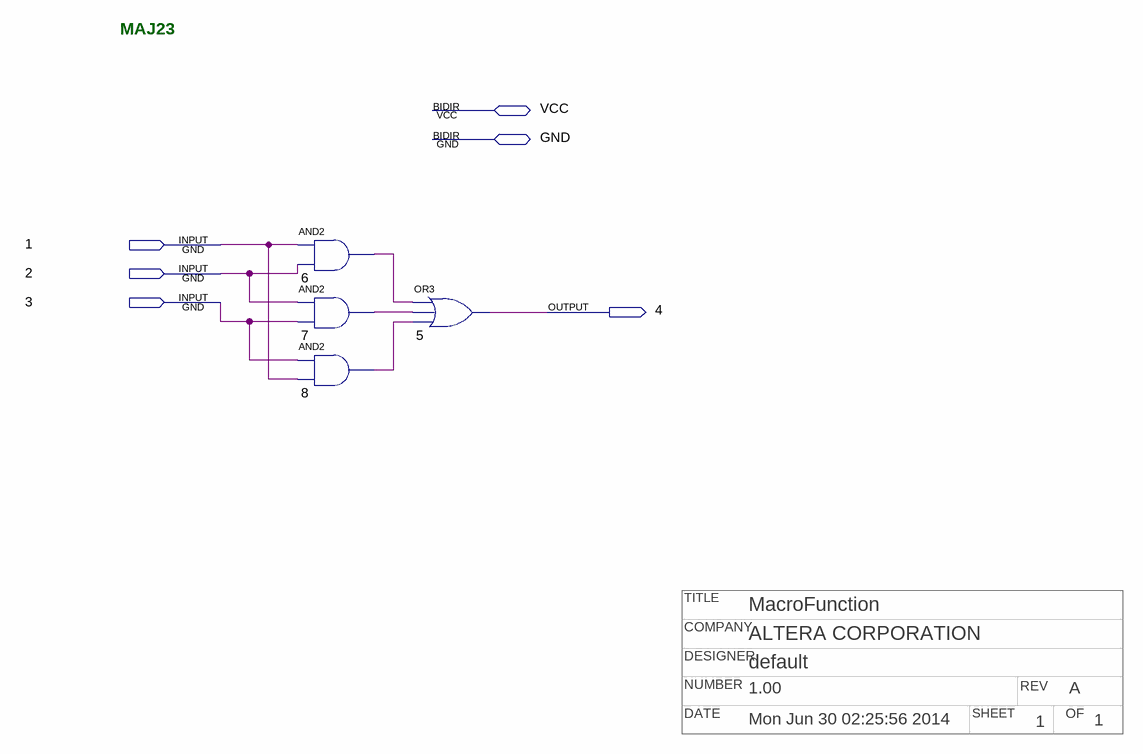
[diagram p0: schematic sheet]
// Quartus schematic npmaj23.bdf as structural Verilog: 4 symbols, 6 pins
// Title block: TITLE: MacroFunction; COMPANY: ALTERA CORPORATION; DESIGNER: default; NUMBER: 1.00; REV: A; DATE: Mon Jun 30 02:25:56 2014; SHEET: 1; OF: 1
module npmaj23 (
  input  \1 ,
  input  \2 ,
  input  \3 ,
  inout  VCC,
  inout  GND,
  output \4 
);

  wire n6_out, n7_out, n8_out;

  and u_6 (n6_out, \1 , \2 );
  and u_7 (n7_out, \2 , \3 );
  and u_8 (n8_out, \3 , \1 );
  or u_5 (\4 , n6_out, n7_out, n8_out);

  // Notes on the sheet:
  //   MAJ23
endmodule
